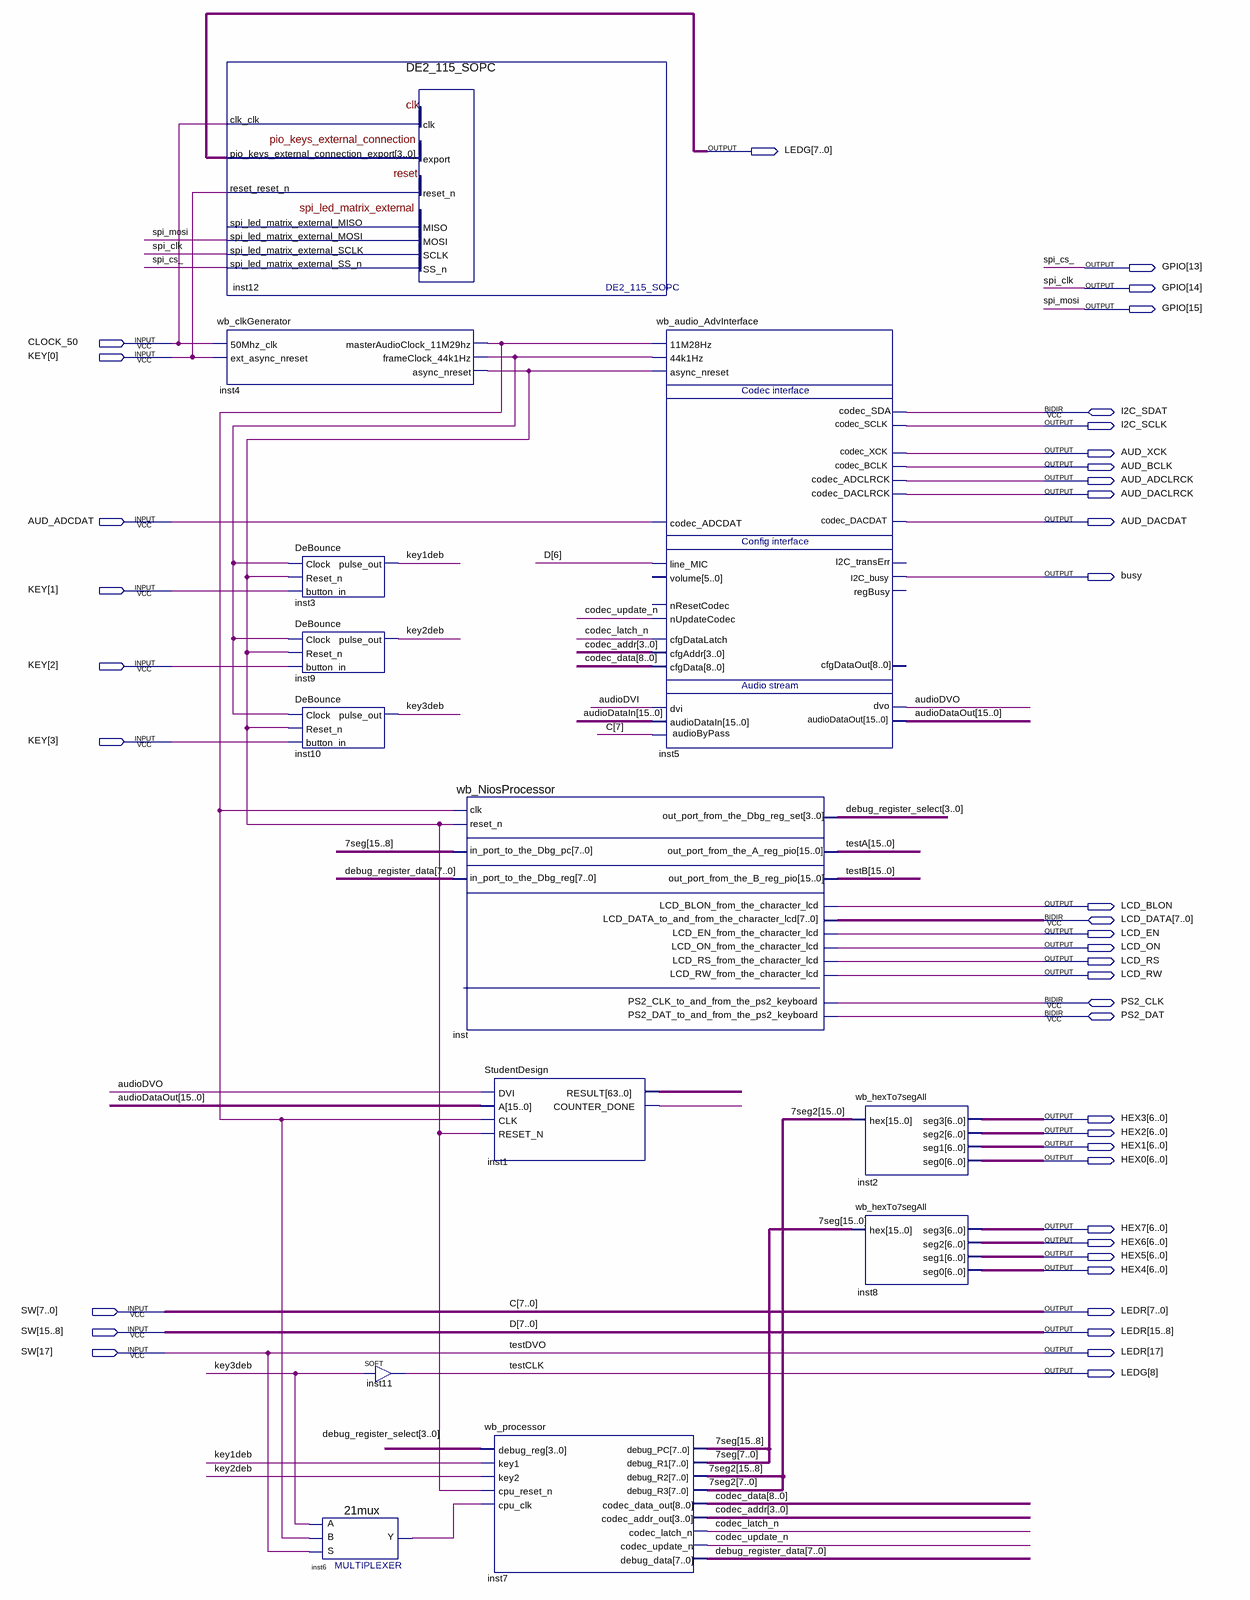
[diagram p0: schematic sheet]
// Quartus schematic Project.bdf as structural Verilog: 13 symbols, 41 pins
module Project (
  input  CLOCK_50,
  input  [3:0] KEY,
  input  AUD_ADCDAT,
  input  [17:0] SW,
  inout  I2C_SDAT,
  inout  [7:0] LCD_DATA,
  inout  PS2_CLK,
  inout  PS2_DAT,
  output [8:0] LEDG,
  output [15:13] GPIO,
  output I2C_SCLK,
  output AUD_XCK,
  output AUD_BCLK,
  output AUD_ADCLRCK,
  output AUD_DACLRCK,
  output AUD_DACDAT,
  output busy,
  output LCD_BLON,
  output LCD_EN,
  output LCD_ON,
  output LCD_RS,
  output LCD_RW,
  output [6:0] HEX3,
  output [6:0] HEX2,
  output [6:0] HEX1,
  output [6:0] HEX0,
  output [6:0] HEX7,
  output [6:0] HEX6,
  output [6:0] HEX5,
  output [6:0] HEX4,
  output [17:0] LEDR
);

  wire audioDVI, audioDVO, codec_latch_n, codec_update_n, inst1_counter_done, inst4_async_nreset,
       inst4_frameclock_44k1hz, inst4_masteraudioclock_11m29hz, inst6_y, key1deb, key2deb, key3deb;
  wire [3:0] codec_addr, debug_register_select;
  wire [7:0] debug_register_data;
  wire [8:0] codec_data;
  wire [15:0] \7seg , \7seg2 , audioDataIn, audioDataOut, testA, testB;
  wire [63:0] inst1_result;

  DE2_115_SOPC inst12 (
    .clk_clk(CLOCK_50), .pio_keys_external_connection_export(LEDG[7:0]), .reset_reset_n(KEY[0]),
    .spi_led_matrix_external_MOSI(GPIO[15]), .spi_led_matrix_external_SCLK(GPIO[14]),
    .spi_led_matrix_external_SS_n(GPIO[13]));  // open: spi_led_matrix_external_MISO
  wb_clkGenerator inst4 (
    .\50Mhz_clk (CLOCK_50), .ext_async_nreset(KEY[0]), .frameClock_44k1Hz(inst4_frameclock_44k1hz),
    .masterAudioClock_11M29hz(inst4_masteraudioclock_11m29hz), .async_nreset(inst4_async_nreset));
  DeBounce inst3 (
    .Clock(inst4_frameclock_44k1hz), .Reset_n(inst4_async_nreset), .button_in(KEY[1]), .pulse_out(key1deb));
  DeBounce inst9 (
    .Clock(inst4_frameclock_44k1hz), .Reset_n(inst4_async_nreset), .button_in(KEY[2]), .pulse_out(key2deb));
  DeBounce inst10 (
    .Clock(inst4_frameclock_44k1hz), .Reset_n(inst4_async_nreset), .button_in(KEY[3]), .pulse_out(key3deb));
  \21mux  inst6 (.S(SW[17]), .B(inst4_masteraudioclock_11m29hz), .A(key3deb), .Y(inst6_y));
  SOFT inst11 (.IN(key3deb), .OUT(LEDG[8]));
  wb_NiosProcessor inst (
    .clk(inst4_masteraudioclock_11m29hz), .reset_n(inst4_async_nreset), .in_port_to_the_Dbg_pc(\7seg [15:8]),
    .in_port_to_the_Dbg_reg(debug_register_data), .out_port_from_the_A_reg_pio(testA),
    .out_port_from_the_B_reg_pio(testB), .out_port_from_the_Dbg_reg_set(debug_register_select),
    .LCD_BLON_from_the_character_lcd(LCD_BLON), .LCD_EN_from_the_character_lcd(LCD_EN),
    .LCD_ON_from_the_character_lcd(LCD_ON), .LCD_RS_from_the_character_lcd(LCD_RS),
    .LCD_RW_from_the_character_lcd(LCD_RW), .LCD_DATA_to_and_from_the_character_lcd(LCD_DATA),
    .PS2_CLK_to_and_from_the_ps2_keyboard(PS2_CLK), .PS2_DAT_to_and_from_the_ps2_keyboard(PS2_DAT));
  StudentDesign inst1 (
    .DVI(audioDVO), .A(audioDataOut), .CLK(inst4_masteraudioclock_11m29hz), .RESET_N(inst4_async_nreset),
    .RESULT(inst1_result), .COUNTER_DONE(inst1_counter_done));
  wb_processor inst7 (
    .debug_reg(debug_register_select), .key1(key1deb), .key2(key2deb), .cpu_reset_n(inst4_async_nreset),
    .cpu_clk(inst6_y), .debug_PC(\7seg [15:8]), .debug_R1(\7seg [7:0]), .debug_R2(\7seg2 [15:8]),
    .debug_R3(\7seg2 [7:0]), .codec_data_out(codec_data), .codec_addr_out(codec_addr),
    .codec_latch_n(codec_latch_n), .codec_update_n(codec_update_n), .debug_data(debug_register_data));
  wb_audio_AdvInterface inst5 (
    .\11M28Hz (inst4_masteraudioclock_11m29hz), .\44k1Hz (inst4_frameclock_44k1hz),
    .async_nreset(inst4_async_nreset), .codec_ADCDAT(AUD_ADCDAT), .nUpdateCodec(codec_update_n),
    .cfgDataLatch(codec_latch_n), .cfgAddr(codec_addr), .cfgData(codec_data), .line_MIC(SW[14]),
    .dvi(audioDVI), .audioDataIn(audioDataIn), .audioByPass(SW[7]), .codec_XCK(AUD_XCK),
    .codec_SDA(I2C_SDAT), .codec_SCLK(I2C_SCLK), .codec_BCLK(AUD_BCLK), .codec_ADCLRCK(AUD_ADCLRCK),
    .codec_DACLRCK(AUD_DACLRCK), .codec_DACDAT(AUD_DACDAT), .I2C_busy(busy), .dvo(audioDVO),
    .audioDataOut(audioDataOut));  // open: nResetCodec, volume, I2C_transErr, regBusy, cfgDataOut
  wb_hexTo7segAll inst2 (.hex(\7seg2 ), .seg3(HEX3), .seg2(HEX2), .seg1(HEX1), .seg0(HEX0));
  wb_hexTo7segAll inst8 (.hex(\7seg ), .seg3(HEX7), .seg2(HEX6), .seg1(HEX5), .seg0(HEX4));

  assign {LEDR[17], LEDR[15:0]} = {SW[17], SW[15:0]};

  // Other names for the same wires on the sheet: C[7:0] = SW[7:0]; D[7:0] = SW[15:8]; spi_clk = GPIO[14];
  //   spi_cs_ = GPIO[13]; spi_mosi = GPIO[15]; testDVO = SW[17]; testCLK = LEDG[8]
endmodule
